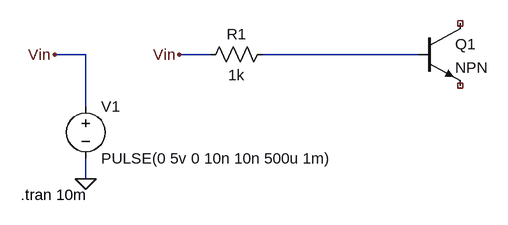
[diagram p0: schematic 2.4.1.asc]
2.4.1.asc, the LTspice schematic file:
Version 4
SHEET 1 880 680
WIRE -32 304 -80 304
WIRE 160 304 112 304
WIRE 480 304 240 304
WIRE -32 384 -32 304
WIRE -32 496 -32 464
FLAG 112 304 Vin
FLAG -32 496 0
FLAG -80 304 Vin
SYMBOL res 256 288 R90
WINDOW 0 0 56 VBottom 2
WINDOW 3 32 56 VTop 2
SYMATTR InstName R1
SYMATTR Value 1k
SYMBOL voltage -32 368 R0
WINDOW 123 0 0 Left 0
WINDOW 39 0 0 Left 0
SYMATTR InstName V1
SYMATTR Value PULSE(0 5v 0 10n 10n 500u 1m)
SYMBOL npn 480 256 R0
SYMATTR InstName Q1
TEXT -132 520 Left 2 !.tran 10m

The netlist it stands for:
* 2.4.1.asc
R1 N001 Vin 1k
V1 Vin 0 PULSE(0 5v 0 10n 10n 500u 1m)
Q1 NC_01 N001 NC_02 0 NPN
.model NPN NPN
.model PNP PNP
.lib standard.bjt
.tran 10m
.backanno
.end